# EAGLE design RCM-Comm_v1_no_ethernet (EAGLE 7.3.0)
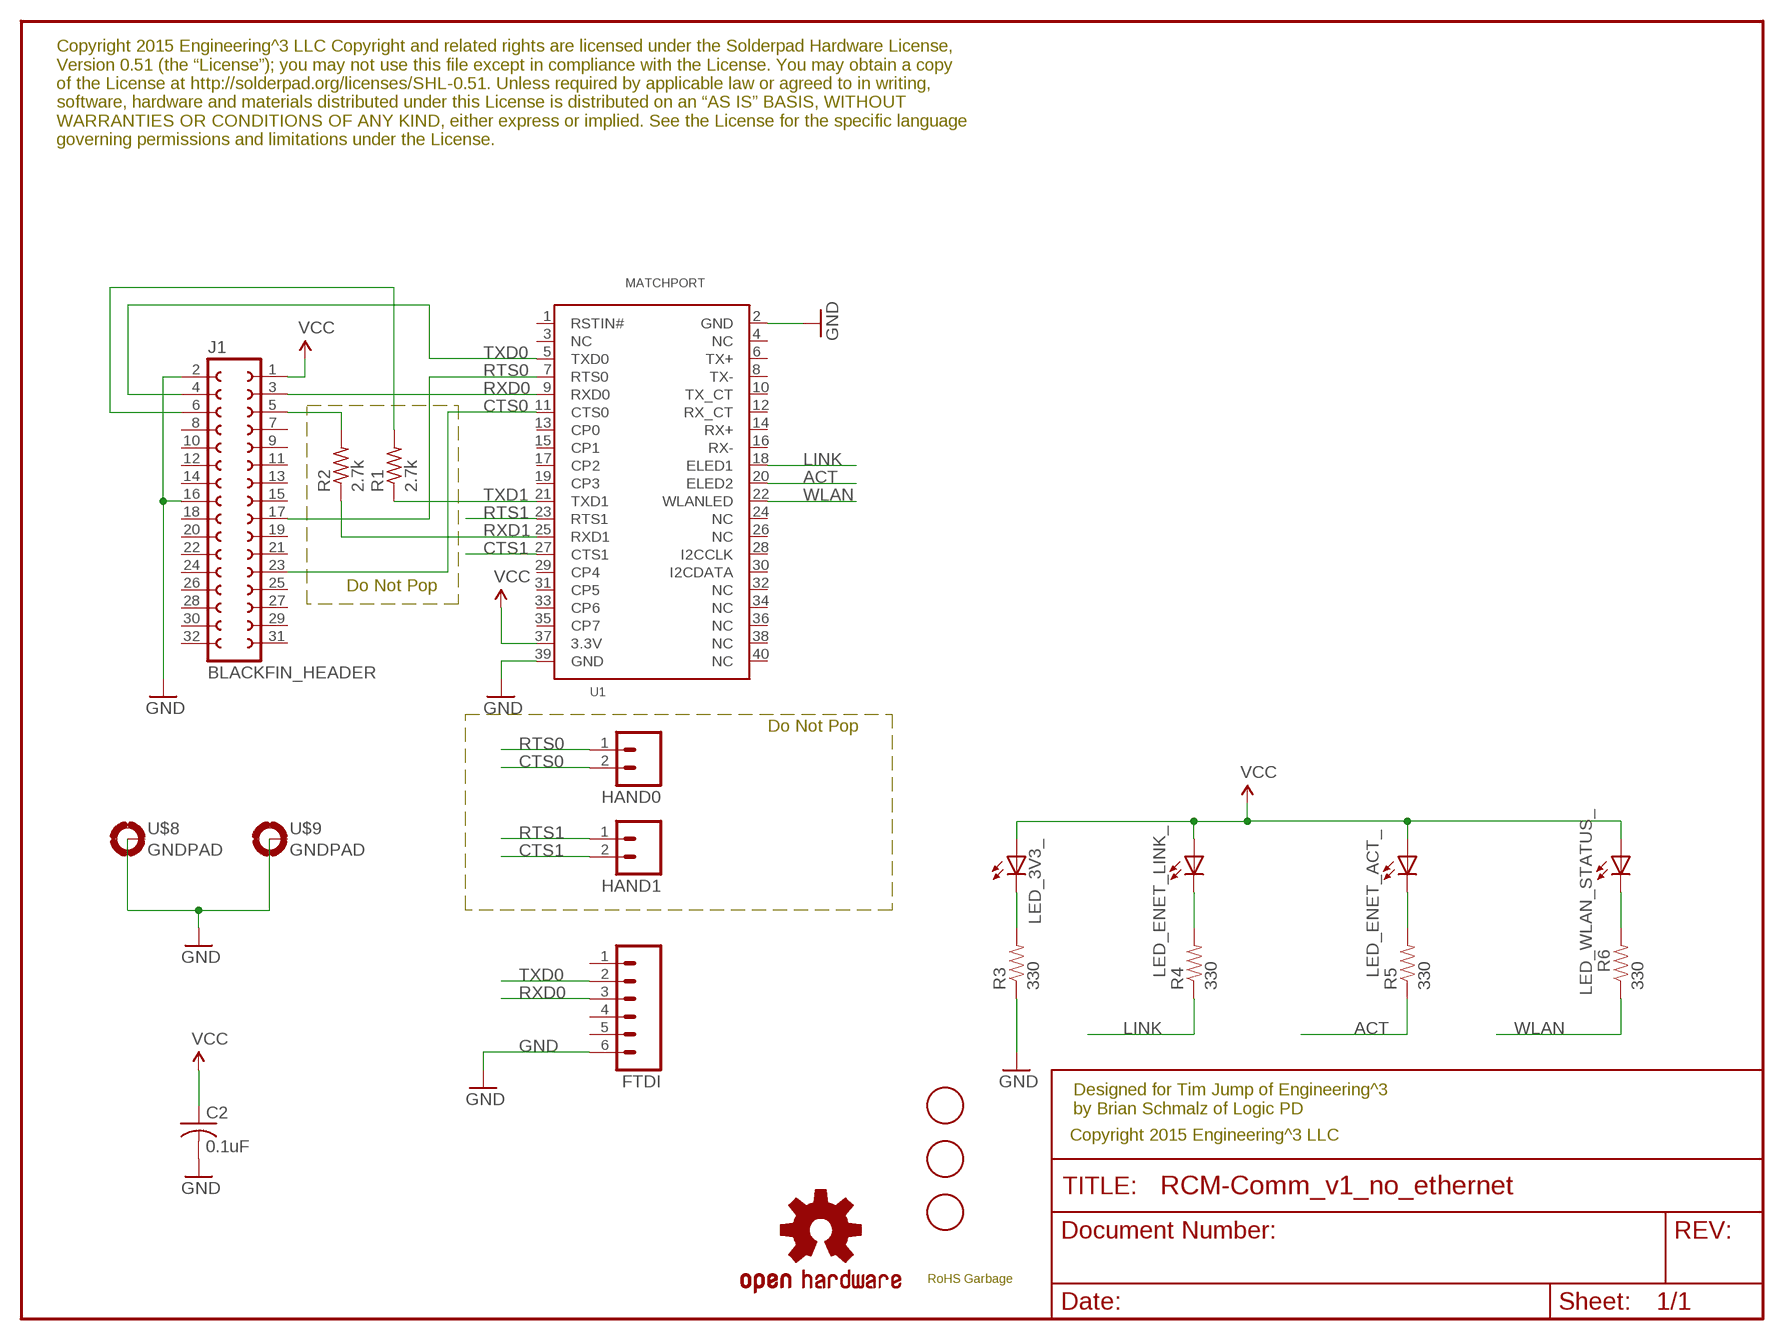
[diagram p0: schematic, sheet 1]

## Parts
C2  0.1uF  C-USC0603  [C0603]
FID1  FIDUCIAL  [FIDUCIAL_1MM]
FID2  FIDUCIAL  [FIDUCIAL_1MM]
FID3  FIDUCIAL  [FIDUCIAL_1MM]
FTDI  M06SIP  [1X06]
HAND0  M02PTH  [1X02]
HAND1  M02PTH  [1X02]
J1  BLACKFIN_HEADER  [2X16]
LED_3V3_  LED0603  [LED-0603]
LED_ENET_ACT_  LED0603  [LED-0603]
LED_ENET_LINK_  LED0603  [LED-0603]
LED_WLAN_STATUS_  LED0603  [LED-0603]
LOGO1  OSHW-LOGOM  [OSHW-LOGO-M]
R1  2.7k  R-US_0207/10  [0207/10]
R2  2.7k  R-US_0207/10  [0207/10]
R3  330  RESISTOR0603-RES  [0603-RES]
R4  330  RESISTOR0603-RES  [0603-RES]
R5  330  RESISTOR0603-RES  [0603-RES]
R6  330  RESISTOR0603-RES  [0603-RES]
U1  MATCHPORT  [MATCHPORT_LAYOUT]
U$3  ROHS_GARBAGE  [ROHS_GARBAGE_5MM]
U$8  GNDPAD  [GNDPAD]
U$9  GNDPAD  [GNDPAD]

## Nets
ACT: R5.1 U1.20(ELED2)
CTS0: HAND0.2 J1.23(GP6) U1.11(CTS0)
CTS1: HAND1.2 U1.27(CTS1)
GND: C2.2 FTDI.6 J1.2(GND) J1.16(GND16) R3.1 U1.2(GND) U1.39(GND) U$8.P$1(MOUNT) U$9.P$1(MOUNT)
LINK: R4.1 U1.18(ELED1)
N$3: LED_3V3_.C R3.2
N$5: LED_ENET_LINK_.C R4.2
N$6: LED_ENET_ACT_.C R5.2
N$8: LED_WLAN_STATUS_.C R6.2
N$24: J1.6(RX1) R1.2
N$26: J1.5(TX1) R2.2
RTS0: HAND0.1 J1.17(GP0) U1.7(RTS0)
RTS1: HAND1.1 U1.23(RTS1)
RXD0: FTDI.3 J1.3(TX0) U1.9(RXD0)
RXD1: R2.1 U1.25(RXD1)
TXD0: FTDI.2 J1.4(RX0) U1.5(TXD0)
TXD1: R1.1 U1.21(TXD1)
VCC: C2.1 J1.1(3.3V) LED_3V3_.A LED_ENET_ACT_.A LED_ENET_LINK_.A LED_WLAN_STATUS_.A U1.37(3.3V)
WLAN: R6.1 U1.22(WLANLED)
Unconnected: FTDI.1 FTDI.4 FTDI.5 J1.7(TMR2) J1.8(TMR3) J1.9(SPI_MOSI) J1.10(SPI_MISO) J1.11(SPI_SCK) J1.12(SPI_SEL) J1.13(SPI_SEL2) J1.14(SPI_SCL) J1.15(I2C_SDA) J1.18(GP1) J1.19(GP2) J1.20(GP3) J1.21(GP4) J1.22(GP5) J1.24(GP7) J1.25(GP8) J1.26(GP9) J1.27(GPA) J1.28(GPB) J1.29(GPC) J1.30(GPD) J1.31(GPE) J1.32(GPF) U1.1(RSTIN#) U1.3(NC) U1.4(NC) U1.6(TX+) U1.8(TX-) U1.10(TX_CT) U1.12(RX_CT) U1.13(CP0) U1.14(RX+) U1.15(CP1) U1.16(RX-) U1.17(CP2) U1.19(CP3) U1.24(NC) U1.26(NC) U1.28(I2CCLK) U1.29(CP4) U1.30(I2CDATA) U1.31(CP5) U1.32(NC) U1.33(CP6) U1.34(NC) U1.35(CP7) U1.36(NC) U1.38(NC) U1.40(NC)

## Notes on the sheet
- Copyright 2015 Engineering^3 LLC Copyright and related rights are licensed under the Solderpad Hardware License, 
  Version 0.51 (the “License”); you may not use this file except in compliance with the License. You may obtain a copy 
  of the License at http://solderpad.org/licenses/SHL-0.51. Unless required by applicable law or agreed to in writing, 
  software, hardware and materials distributed under this License is distributed on an “AS IS” BASIS, WITHOUT 
  WARRANTIES OR CONDITIONS OF ANY KIND, either express or implied. See the License for the specific language 
  governing permissions and limitations under the License.
- Do Not Pop
- Do Not Pop
- Designed for Tim Jump of Engineering^3
  by Brian Schmalz of Logic PD
- Copyright 2015 Engineering^3 LLC

## Library data of the parts
C2 = rcl:C-US: CAPACITOR, American symbol
FID1-FID3 = adafruit:FIDUCIAL: For use by pick and place machines to calibrate the vision/machine, 1mm By microbuilder.eu
FTDI = spark_fun:M06: Header 6 Standard 6-pin 0.1" header. Use with straight break away headers (SKU : PRT-00116), right angle break away headers (PRT-00553), swiss pins (PRT-00743), machine pins (PRT-00117), and female headers (PRT-00115). Molex polarized connector foot print use with SKU : PRT-08094 with associated crimp pins and housings. NOTES ON THE VARIANTS LOCK and LOCK_LONGPADS... This footprint was designed to help hold the alignment of a through-hole component (i.e. 6-pin header) while soldering it into place. You may notice that each hole has been shifted either up or down by 0.005 of an inch from it's more standard position (which is a perfectly straight line). This slight alteration caused the pins (the squares in the middle) to touch the edges of the holes. Because they are alternating, it causes a "brace" to hold the component in place. 0.005 has proven to be the perfect amount of "off-center" position when using our standard breakaway headers. Although looks a little odd when you look at the bare footprint, once you have a header in there, the alteration is very hard to notice. Also, if you push a header all the way into place, it is covered up entirely on the bottom side. This idea of altering the position of holes to aid alignment will be further integrated into the Sparkfun Library for other footprints. It can help hold any component with 3 or more connection pins.
HAND0 HAND1 = spark_fun:M02: Header 2 Standard 2-pin 0.1" header. Use with straight break away headers (SKU : PRT-00116), right angle break away headers (PRT-00553), swiss pins (PRT-00743), machine pins (PRT-00117), and female headers (PRT-00115). Molex polarized connector foot print use with SKU : PRT-08233 with associated crimp pins and housings.
J1 = Surveyor:BLACKFIN_HEADER
LED_3V3_ LED_ENET_ACT_ LED_ENET_LINK_ LED_WLAN_STATUS_ = spark_fun:LED: LEDs Standard schematic elements and footprints for 5mm, 3mm, 1206, and 0603 sized LEDs. 5mm - Spark Fun Electronics SKU : COM-00529 (and others)
LOGO1 = SparkFun-Aesthetics:OSHW-LOGO: Open Source Hardware Logo This logo indicates the piece of hardware it is found on incorporates a OSHW license and/or adheres to the definition of open source hardware found here: http://freedomdefined.org/OSHW
R1 R2 = rcl:R-US_: RESISTOR, American symbol
R3-R6 = spark_fun:RESISTOR: Resistor Basic schematic elements and footprints for 0603, 1206, and PTH resistors.
U1 = Matchport_Wiport:MATCHPORT
U$3 = SchmalzHausPublic:ROHS_GARBAGE
U$8 U$9 = Surveyor:GNDPAD

## Board
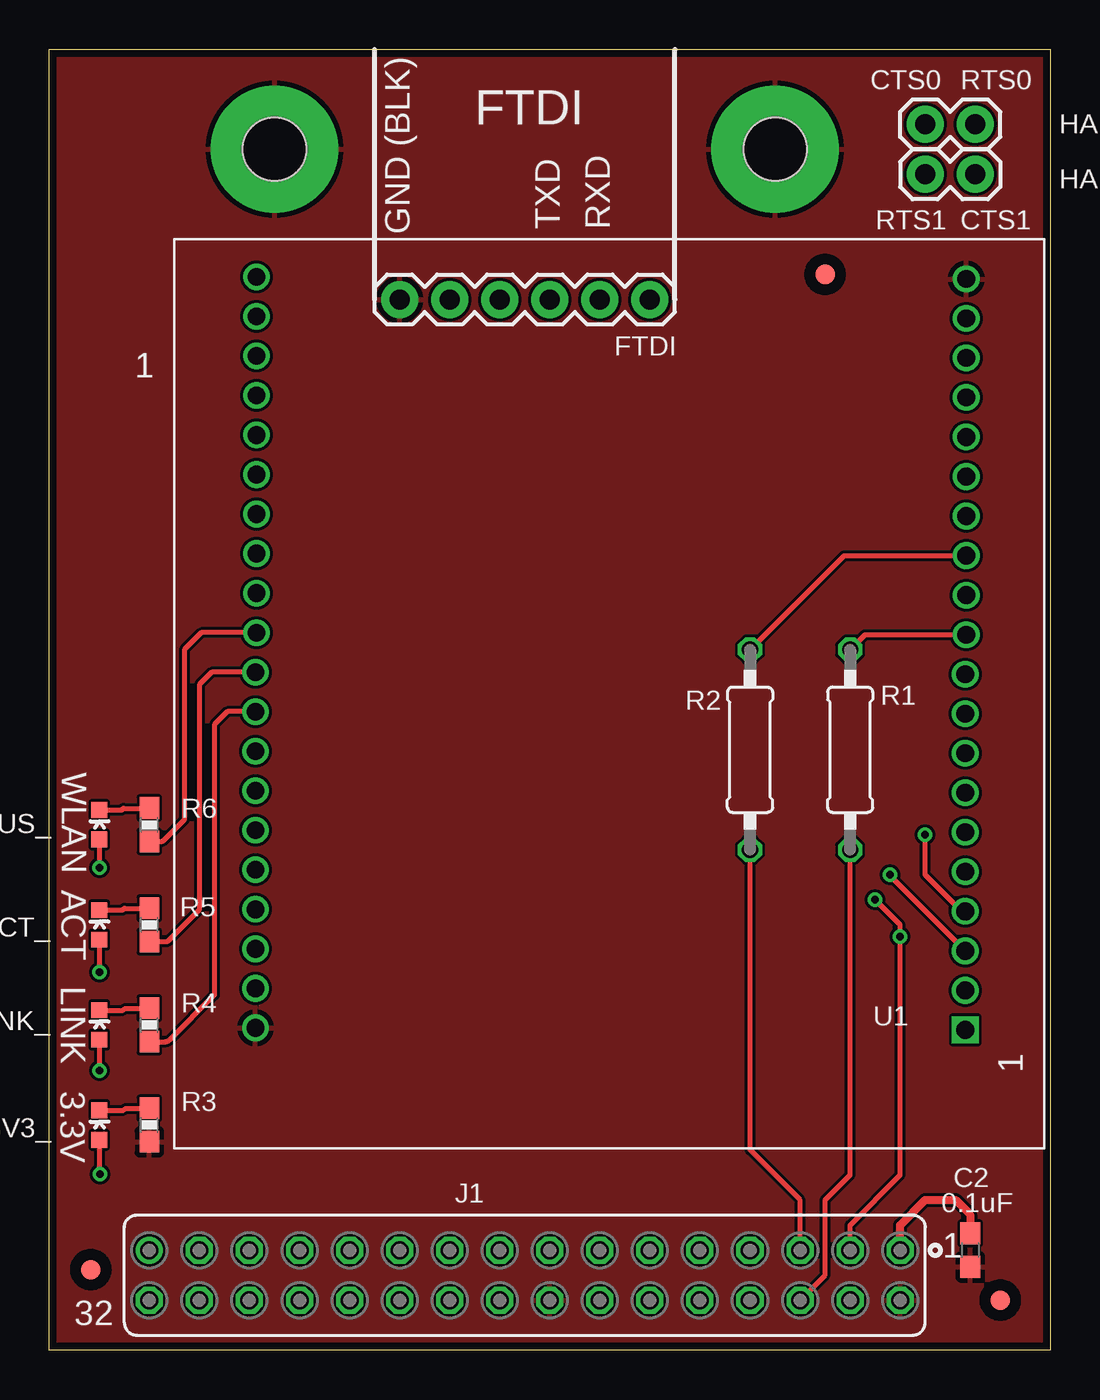
[diagram p1: board, top side]
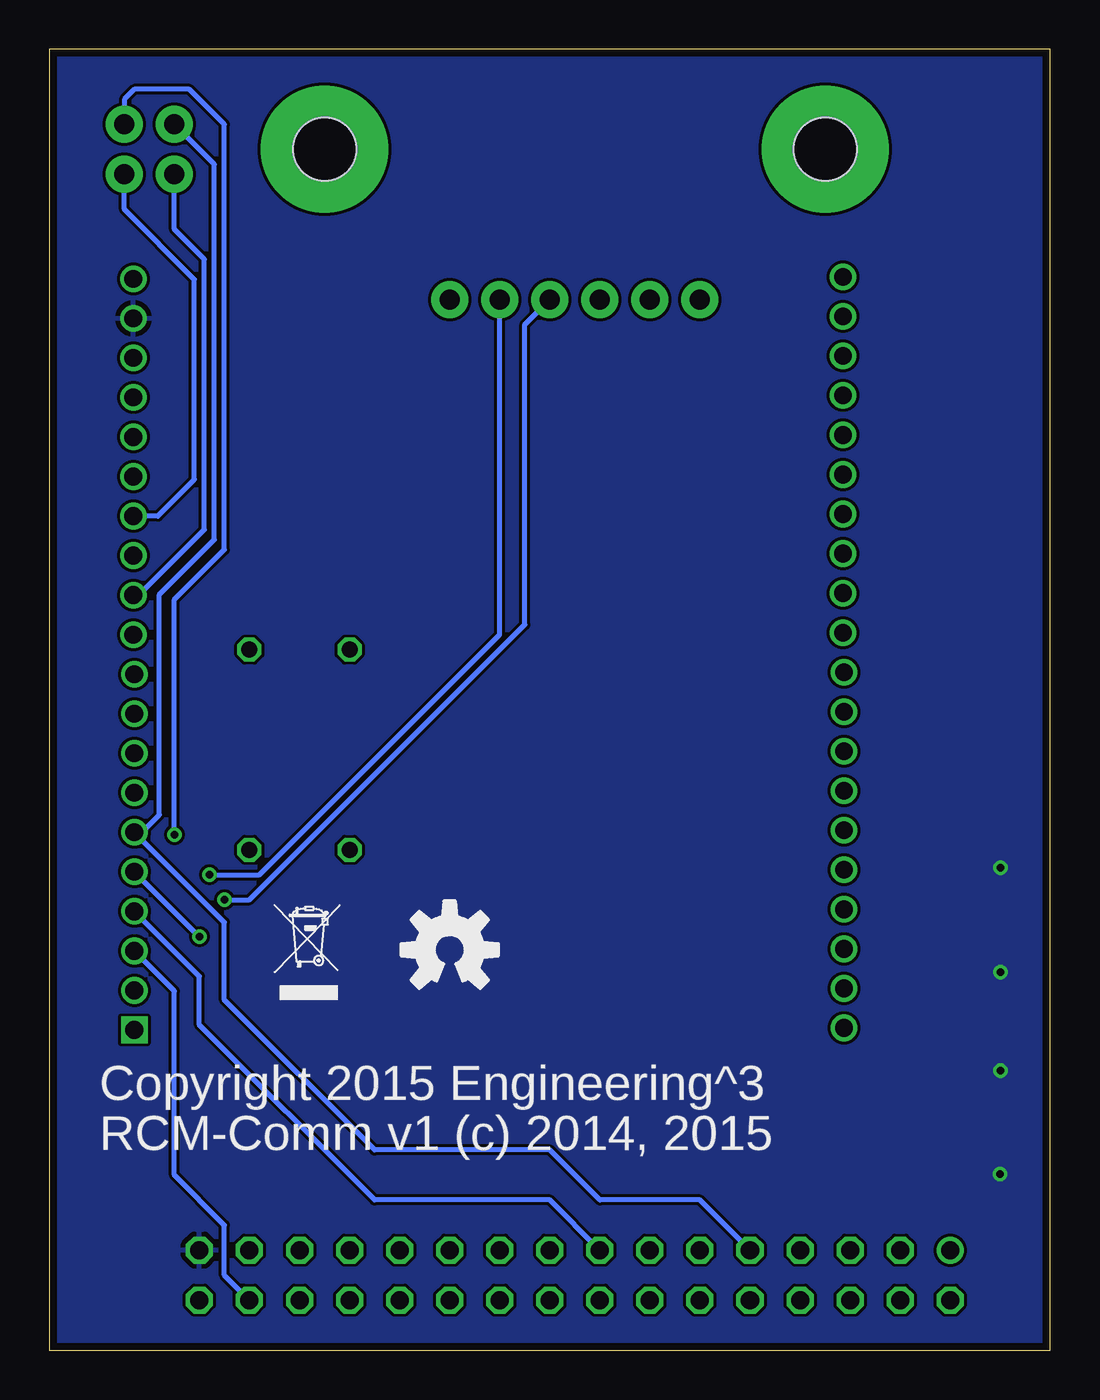
[diagram p2: board, bottom side, seen from below]

Size 50.8 x 66.05 mm. Coordinates in mm from the lower left corner, seen from the top.
Outline: 0,66.05 50.8,66.05 50.8,43.69 50.8,0 0,0.01 0,66.05
Copper layers (1*16): Top 0.0356mm / dielectric 1.5011mm / Bottom 0.0356mm
Design rules "LaenPCBOrder": minimum track width 6mil, minimum drill 13mil, track to track 6mil, track to pad 6mil, pad to pad 6mil, via to via 6mil, smd to smd 6mil, copper to edge 15mil, drill to drill 6mil, minimum pad ring 7mil, minimum via ring 7mil, stop-mask expansion 3mil, vias tented up to drill 0mil, thermal gap 10mil

### Footprints (pad centres in the part's own frame; a part is rotated, then mirrored left to right if it is on the bottom)
C0603 = smd 1.1 x 1: 1 -0.85,0; 2 0.85,0
FIDUCIAL_1MM = smd 1 x 1: 1 0,0
1X06 = drill 1.016 pad 1.88: 1 0,0; 2 2.54,0; 3 5.08,0; 4 7.62,0; 5 10.16,0; 6 12.7,0
1X02 = drill 1.016 pad 1.88: 1 0,0; 2 2.54,0
2X16 = drill 0.914 octagon: 1 20.32,1.27; 2 20.32,-1.27; 3 17.78,1.27; 4 17.78,-1.27; 5 15.24,1.27; 6 15.24,-1.27; 7 12.7,1.27; 8 12.7,-1.27; 9 10.16,1.27; 10 10.16,-1.27; 11 7.62,1.27; 12 7.62,-1.27; 13 5.08,1.27; 14 5.08,-1.27; 15 2.54,1.27; 16 2.54,-1.27; 17 0,1.27; 18 0,-1.27; 19 -2.54,1.27; 20 -2.54,-1.27; 21 -5.08,1.27; 22 -5.08,-1.27; 23 -7.62,1.27; 24 -7.62,-1.27; 25 -10.16,1.27; 26 -10.16,-1.27; 27 -12.7,1.27; 28 -12.7,-1.27; 29 -15.24,1.27; 30 -15.24,-1.27; 32 -17.78,-1.27 | drill 0.914: 31 -17.78,1.27
LED-0603 = smd 0.8 x 0.8: A 0,-0.75; C 0,0.75
0207/10 = drill 0.813 octagon: 1 -5.08,0; 2 5.08,0
0603-RES = smd 1.1 x 1: 1 -0.85,0; 2 0.85,0
MATCHPORT_LAYOUT = drill 0.9 square: 1 0,0 | drill 0.9: 2 36.017,-0.102; 3 0,-2.007; 4 36.017,-2.108; 5 0,-4.013; 6 36.017,-4.115; 7 0,-6.02; 8 36.017,-6.121; 9 0,-8.026; 10 36.017,-8.128; 11 0,-10.033; 12 36.017,-10.135; 13 0,-12.04; 14 36.017,-12.141; 15 0,-14.046; 16 36.017,-14.148; 17 0,-16.053; 18 36.017,-16.154; 19 0,-18.059; 20 36.017,-18.161; 21 -0.051,-20.066; 22 35.966,-20.168; 23 -0.051,-22.073; 24 35.966,-22.174; 25 -0.051,-24.079; 26 35.966,-24.181; 27 -0.051,-26.086; 28 35.966,-26.187; 29 -0.051,-28.092; 30 35.966,-28.194; 31 -0.051,-30.099; 32 35.966,-30.201; 33 -0.051,-32.106; 34 35.966,-32.207; 35 -0.051,-34.112; 36 35.966,-34.214; 37 -0.051,-36.119; 38 35.966,-36.22; 39 -0.051,-38.125; 40 35.966,-38.227
GNDPAD = drill 3.2 pad 6.452: P$1 0,0 | hole 3.2: 0,0

### Placement (x,y rotation side)
C2  46.74,5.08 270 top
FID1  2.11,4.09 0 top
FID2  39.37,54.62 0 top
FID3  48.26,2.54 0 top
FTDI  30.48,53.35 180 top
HAND0  46.99,62.23 180 top
HAND1  44.45,59.7 0 top
J1  22.86,3.81 0 top
LED_3V3_  2.54,11.44 0 top
LED_ENET_ACT_  2.54,21.59 0 top
LED_ENET_LINK_  2.54,16.52 0 top
LED_WLAN_STATUS_  2.54,26.68 0 top
LOGO1  30.48,20.32 0 bottom
R1  40.64,30.48 270 top
R2  35.56,30.48 270 top
R3  5.08,11.44 90 top
R4  5.08,16.52 90 top
R5  5.08,21.59 90 top
R6  5.08,26.68 90 top
U1  46.48,16.26 180 top
U$3  39.37,17.79 0 bottom
U$8  11.43,60.97 90 top
U$9  36.83,60.97 0 top

### Tracks (layer width: path | path; a pad name or v marks a point on that pad's centre or on a via)
ACT
  Top 0.254: U1.20 8.26,34.42 7.62,33.79 7.62,22.36 6.08,20.82 arc-45 5.9,20.74 R5.1
CTS0
  Bottom 0.254: J1.23 17.78,7.62 22.86,7.62 25.4,10.17 34.29,10.17 41.91,17.79 41.91,21.72 U1.11 46.1,26.29 45.21,27.18 45.21,38.36 42.42,41.15 42.42,60.2 HAND0.2
CTS1
  Bottom 0.254: U1.27 45.29,42.35 43.43,44.2 43.43,54.36 46.99,57.92 HAND1.2
GND
  pour Top: 0,66.05 50.8,66.05 50.8,0.01 0,0.01
LINK
  Top 0.254: U1.18 9.04,32.41 8.38,31.75 8.38,18.04 6.08,15.74 arc-45 5.9,15.67 R4.1
N$3
  Top 0.254: LED_3V3_.C 3.77,12.19 3.86,12.27 5.07,12.27 R3.2
N$5
  Top 0.254: LED_ENET_LINK_.C 3.75,17.27 3.83,17.35 5.07,17.35 R4.2
N$6
  Top 0.254: LED_ENET_ACT_.C 3.72,22.34 3.81,22.43 5.07,22.43 R5.2
N$8
  Top 0.254: LED_WLAN_STATUS_.C 3.67,27.43 3.76,27.51 5.07,27.51 R6.2
N$24
  Top 0.254: R1.2 40.64,8.9 39.37,7.62 39.37,3.81 J1.6
N$26
  Top 0.254: J1.5 38.1,7.62 35.56,10.17 R2.2
RTS0  (via drill 0.38)
  Top 0.254: v44.45,26.17 44.45,24.13 46.3,22.28 U1.7
  Bottom 0.254: v44.45,26.17 44.45,38.11 41.91,40.65 41.91,62.23 43.69,64.01 46.48,64.01 46.99,63.51 HAND0.1 | J1.17 25.4,7.62 34.29,7.62 43.18,16.52 43.18,18.98 U1.7
RTS1
  Bottom 0.254: U1.23 46.25,38.33 42.93,41.66 42.93,55.38 44.45,56.9 HAND1.1
RXD0  (via drill 0.38)
  Top 0.254: J1.3 40.64,6.35 43.18,8.9 v43.18,20.98 43.18,21.59 v41.91,22.86
  Bottom 0.254: v43.18,20.98 U1.9 | v41.91,22.86 40.64,22.86 26.67,36.84 26.67,52.08 FTDI.3
RXD1
  Top 0.254: U1.25 40.34,40.34 R2.1
TXD0  (via drill 0.38)
  Top 0.254: v42.67,24.13 42.67,24.08 U1.5
  Bottom 0.254: J1.4 41.91,3.81 41.91,6.35 44.45,8.9 44.45,18.24 U1.5 | FTDI.2 27.94,36.33 40.13,24.13 v42.67,24.13
TXD1
  Top 0.254: U1.21 41.4,36.33 R1.1
VCC  (via drill 0.38)
  Top 0.254: LED_WLAN_STATUS_.A v2.54,24.49 | LED_ENET_ACT_.A v2.54,19.18 | LED_ENET_LINK_.A v2.54,14.2 | LED_3V3_.A 2.54,9.01 arc45 v2.56,8.95
  Top 0.406: J1.1 43.18,6.35 44.45,7.62 46,7.62 46.74,6.89 C2.1
  Bottom 0.254: v2.54,24.49 2.56,24.49 arc45 2.62,24.52 | v2.54,19.18 2.63,19.18 arc-45 2.69,19.16 | v2.54,14.2 2.67,14.2 | v2.56,8.95 2.69,8.95
  pour Bottom: 0,66.05 50.8,66.05 50.8,0.01 0,0.01
WLAN
  Top 0.254: U1.22 7.72,36.43 6.86,35.57 6.86,26.93 5.83,25.9 arc-45 5.65,25.82 R6.1

### Text on the board
tPlace: CTS0 | RTS0 | FTDI | GND (BLK) | TXD | RXD | RTS1 | CTS1 | 1 | WLAN | ACT | LINK | 1 | 3.3V
bPlace: Copyright 2015 Engineering^3 | RCM-Comm v1 (c) 2014, 2015